# EAGLE design spin (EAGLE 6.4)
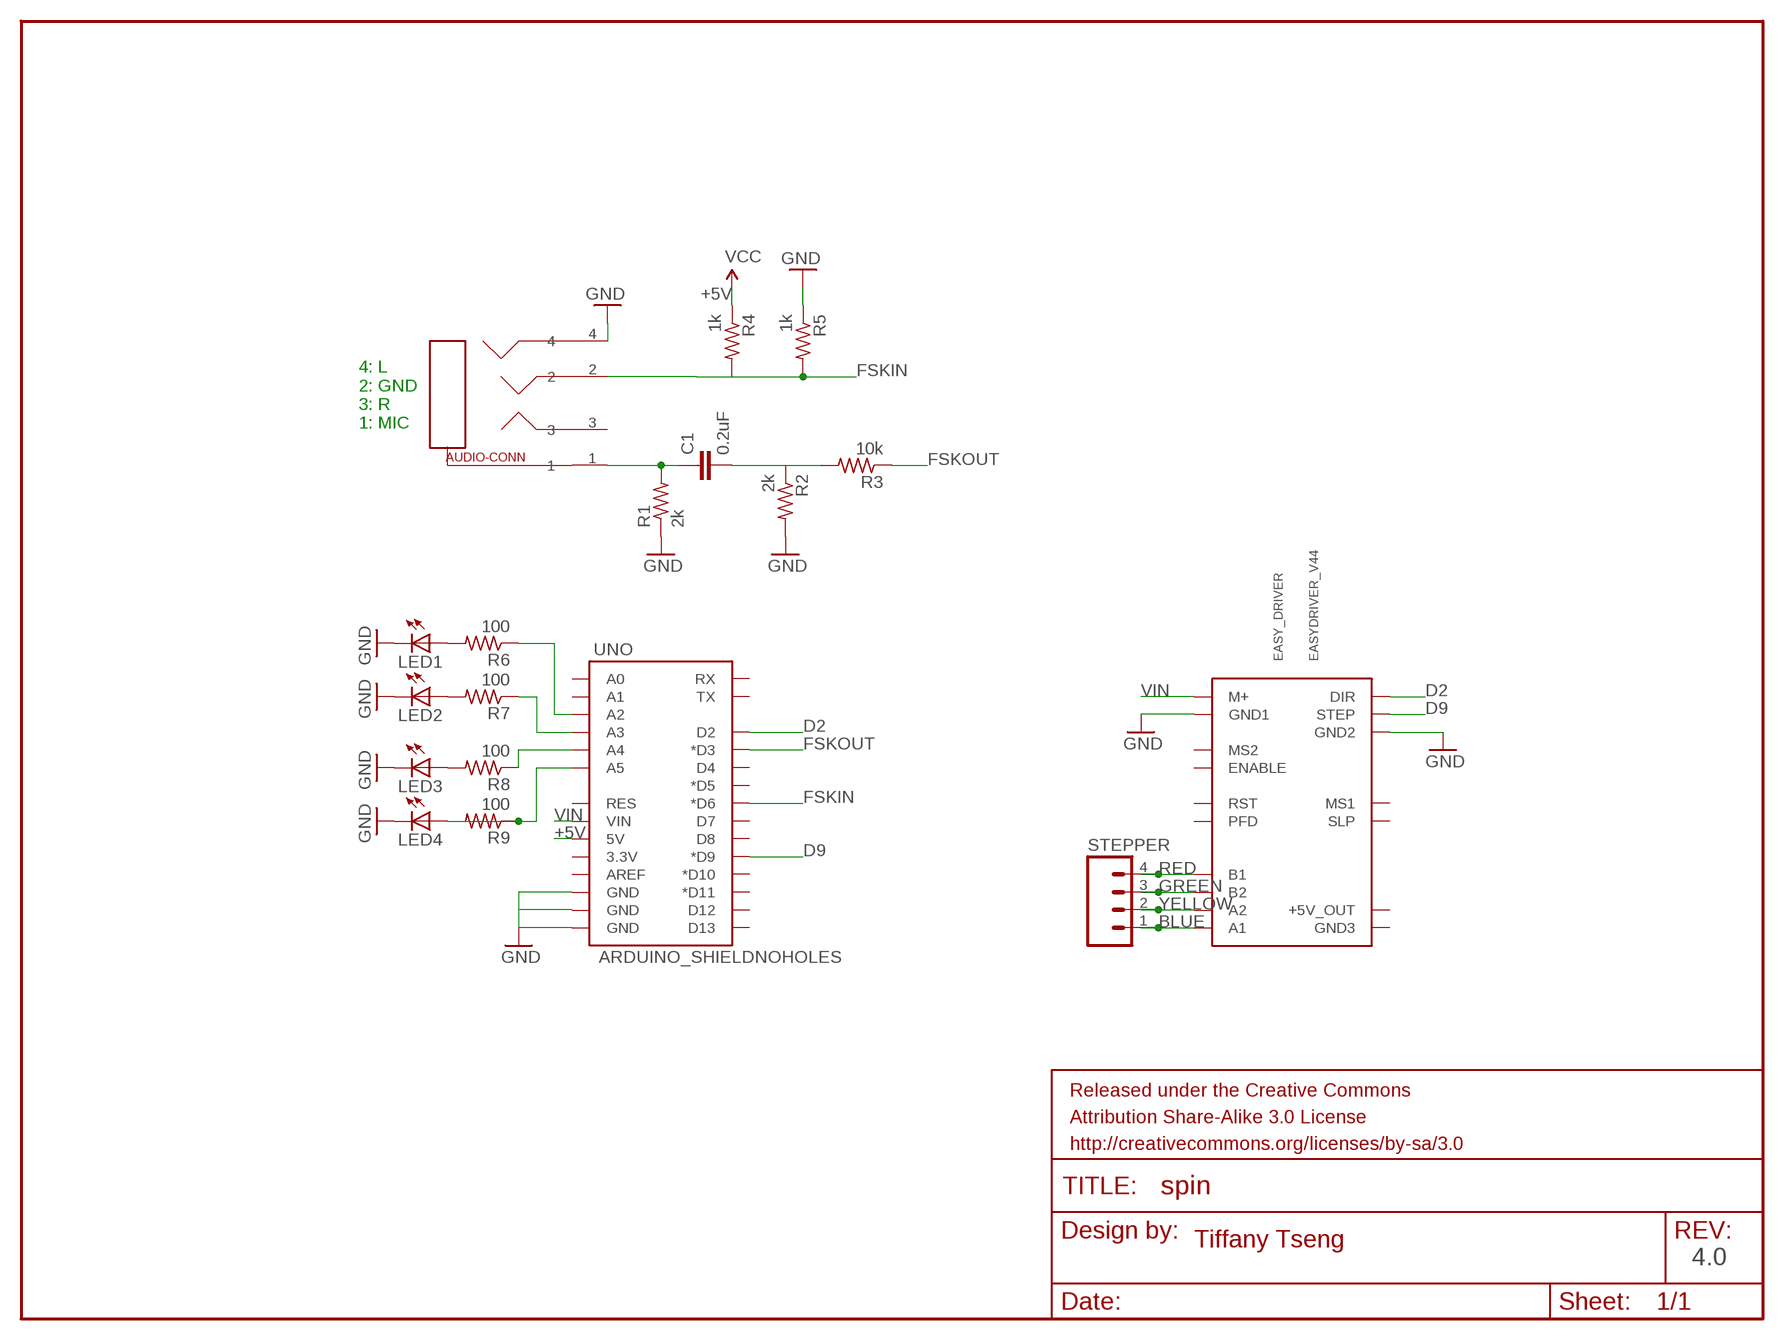
[diagram p0: schematic, sheet 1]

## Parts
C1  0.2uF  CAP1206  [1206]
EASY_DRIVER  EASYDRIVER_V44  [EASYDRIVER_V44]
FRAME1  FRAME-LETTER  [CREATIVE_COMMONS]
LED1  LED1206  [1206]
LED2  LED1206  [1206]
LED3  LED1206  [1206]
LED4  LED1206  [1206]
R1  2k  R-US_R1206  [R1206]
R2  2k  R-US_R1206  [R1206]
R3  10k  R-US_R1206  [R1206]
R4  1k  R-US_R1206  [R1206]
R5  1k  R-US_R1206  [R1206]
R6  100  R-US_R1206  [R1206]
R7  100  R-US_R1206  [R1206]
R8  100  R-US_R1206  [R1206]
R9  100  R-US_R1206  [R1206]
STEPPER  M04PTH  [1X04]
U$1  SJ-43514  [SJ-43514]
UNO  ARDUINO_SHIELDNOHOLES  [DUEMILANOVE_SHIELD_NOHOLES]

## Nets
1: C1.1 R1.2 U$1.1
+5V: R4.1 UNO.5V ; supply symbol labelled VCC
BLUE: EASY_DRIVER.A1 STEPPER.1
D2: EASY_DRIVER.DIR UNO.D2
D9: EASY_DRIVER.STEP UNO.D9(*D9)
FSKIN: R4.2 R5.2 U$1.2 UNO.D6(*D6)
FSKOUT: R3.1 UNO.D3(*D3)
GND: EASY_DRIVER.GND1 EASY_DRIVER.GND2 LED1.2(C) LED2.2(C) LED3.2(C) LED4.2(C) R1.1 R2.2 R5.1 U$1.4 UNO.GND@0(GND) UNO.GND@1(GND) UNO.GND@2(GND)
GREEN: EASY_DRIVER.B2 STEPPER.3
N$2: C1.2 R2.1 R3.2
N$10: R9.1 UNO.A5
N$11: LED1.1(A) R6.2
N$12: LED2.1(A) R7.2
N$13: R8.1 UNO.A4
N$14: LED3.1(A) R8.2
N$15: R7.1 UNO.A3
N$16: LED4.1(A) R9.2
N$17: R6.1 UNO.A2
RED: EASY_DRIVER.B1 STEPPER.4
VIN: EASY_DRIVER.M+ UNO.VIN
YELLOW: EASY_DRIVER.A2 STEPPER.2
Unconnected: EASY_DRIVER.ENABLE EASY_DRIVER.GND3 EASY_DRIVER.MS1 EASY_DRIVER.MS2 EASY_DRIVER.P$11(+5V_OUT) EASY_DRIVER.PFD EASY_DRIVER.RST EASY_DRIVER.SLEEP(SLP) U$1.3 UNO.3.3V UNO.A0 UNO.A1 UNO.AREF UNO.D4 UNO.D5(*D5) UNO.D7 UNO.D8 UNO.D10(*D10) UNO.D11(*D11) UNO.D12 UNO.D13 UNO.RES UNO.RX UNO.TX

## Notes on the sheet
- 4: L
  2: GND
  3: R
  1: MIC
- Tiffany Tseng
- 4.0

## Library data of the parts
C1 = SparkFun-Passives:CAP: Capacitor Standard 0603 ceramic capacitor, and 0.1" leaded capacitor.
EASY_DRIVER = EasyDriver:EASYDRIVER_V44: EasyDriver version 4.4 - http://www.schmalzhaus.com/EasyDriver
FRAME1 = SparkFun-Aesthetics:FRAME-LETTER: Schematic Frame Standard 8.5x11 US Letter frame
LED1-LED4 = ng:LED
R1-R9 = rcl:R-US_: RESISTOR, American symbol
STEPPER = SparkFun-Connectors:M04: Header 4 Standard 4-pin 0.1" header. Use with straight break away headers (SKU : PRT-00116), right angle break away headers (PRT-00553), swiss pins (PRT-00743), machine pins (PRT-00117), and female headers (PRT-00115). Molex polarized connector foot print use with SKU : PRT-08231 with associated crimp pins and housings. 1MM SMD Version SKU: PRT-10208
U$1 = spin:SJ-43514
UNO = SparkFun-Boards:ARDUINO_SHIELD: Arduino shield footprint

## Board
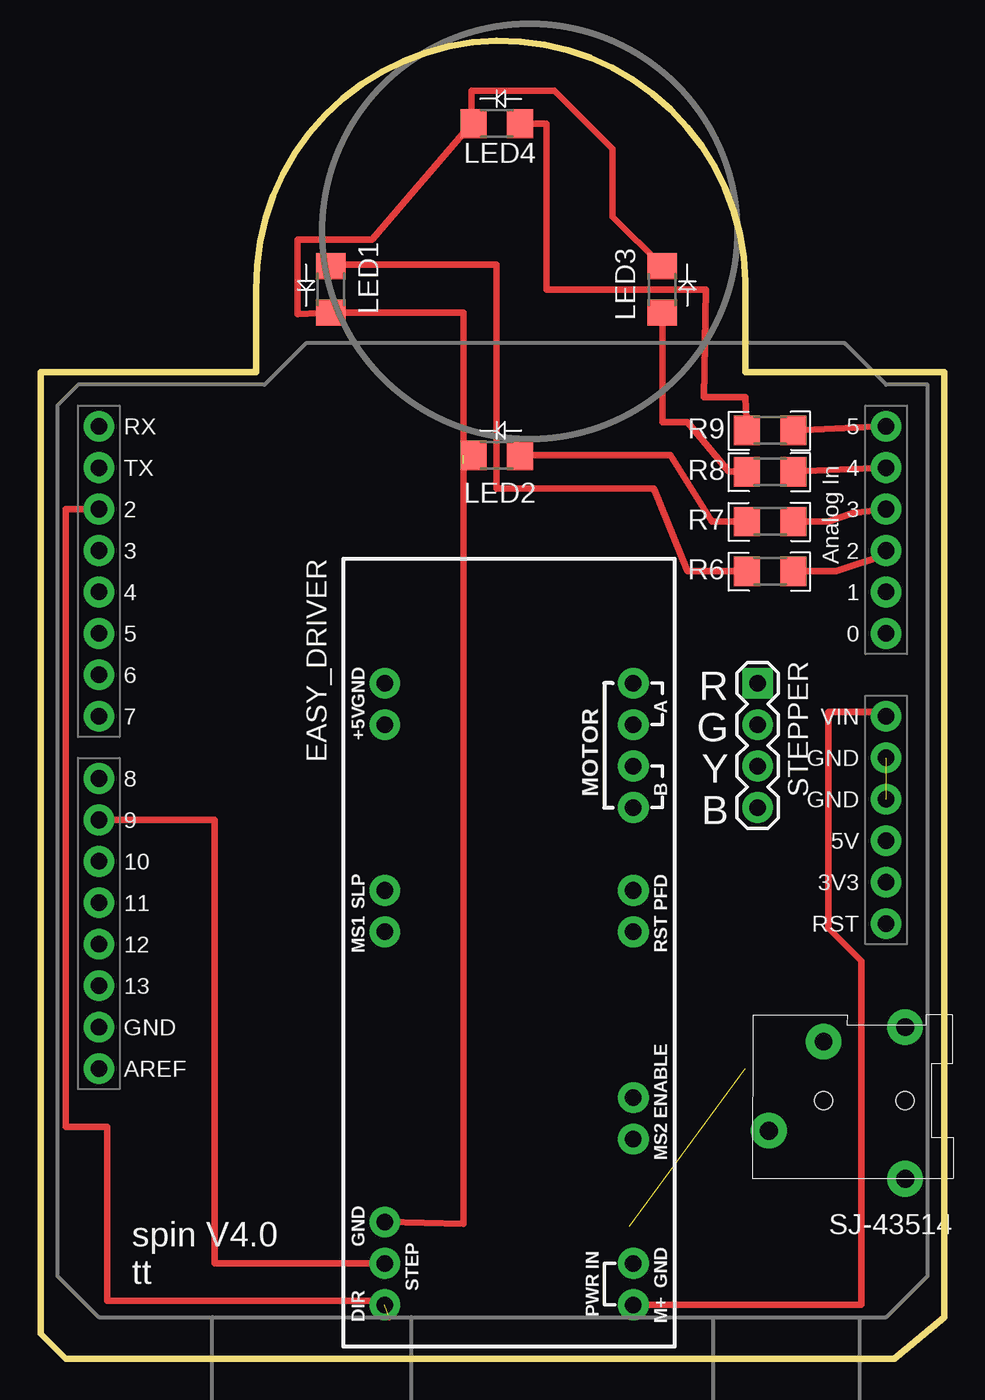
[diagram p1: board, top side]
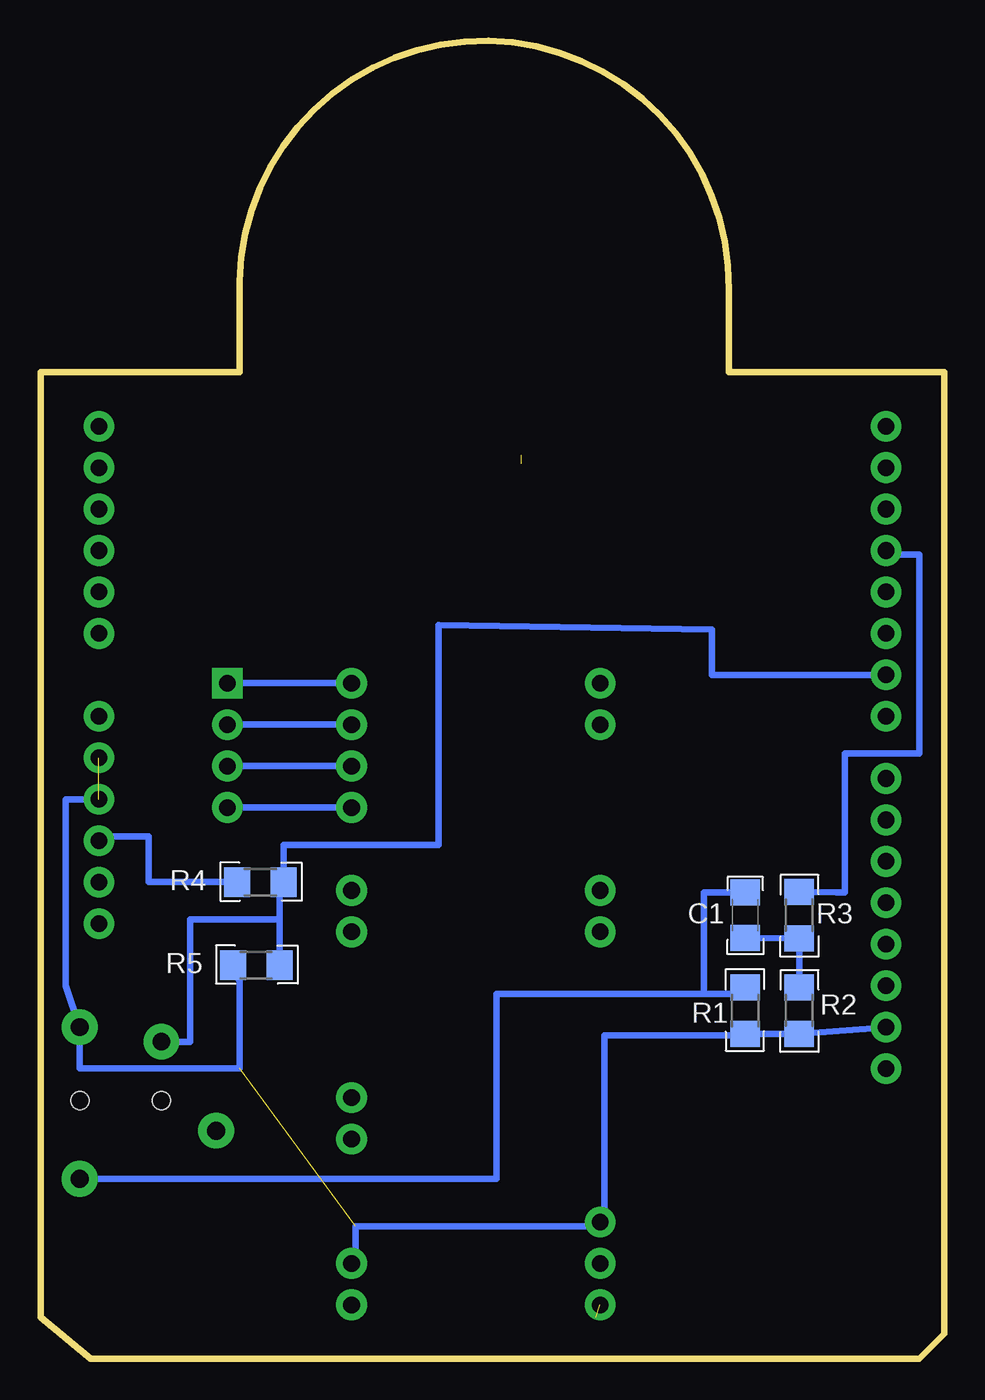
[diagram p2: board, bottom side, seen from below]

Size 55.37 x 80.77 mm. Coordinates in mm from the lower left corner, seen from the top.
Outline: 55.37,55.88 55.37,2.54 52.32,0 3.56,0 1.52,0 0,1.52 0,55.37 0,60.45 13.21,60.45 13.21,65.53 arc-180 43.18,66.04 43.18,60.45 55.37,60.45 55.37,55.88
Copper layers (1*16): Top 0.035mm / dielectric 1.5mm / Bottom 0.035mm
Design rules "default": minimum track width 10mil, minimum drill 24mil, track to track 8mil, track to pad 8mil, pad to pad 8mil, via to via 8mil, smd to smd 8mil, copper to edge 40mil, drill to drill 8mil, minimum pad ring 10mil, minimum via ring 8mil, stop-mask expansion 4mil, vias tented up to drill 0mil, thermal gap 10mil

### Footprints (pad centres in the part's own frame; a part is rotated, then mirrored left to right if it is on the bottom)
1206 = smd 1.6 x 1.8: 1 -1.4,0; 2 1.4,0
EASYDRIVER_V44 = drill 1.016 pad 1.88: A1 -16.51,7.62; A2 -13.97,7.62; B1 -8.89,7.62; B2 -11.43,7.62; DIR 21.59,-7.62; ENABLE 8.89,7.62; GND1 19.05,7.62; GND2 16.51,-7.62; GND3 -16.51,-7.62; M+ 21.59,7.62; MS1 -1.27,-7.62; MS2 11.43,7.62; P$11 -13.97,-7.62; PFD -3.81,7.62; RST -1.27,7.62; SLEEP -3.81,-7.62; STEP 19.05,-7.62
1206' = smd 1.6 x 1.803: 1 -1.422,0; 2 1.422,0
R1206 = smd 1.6 x 1.803: 1 -1.422,0; 2 1.422,0
1X04 = drill 1.016 pad 1.88 square: 1 0,0 | drill 1.016 pad 1.88: 2 2.54,0; 3 5.08,0; 4 7.62,0
SJ-43514 = drill 1.092 pad 2.184: 1 2.896,9.296; 2 7.899,0.889; 3 11.252,6.35; 4 2.896,0 | hole 1.092: 2.896,4.496; 7.899,4.496
DUEMILANOVE_SHIELD_NOHOLES = drill 1.016 pad 1.88: 3.3V 50.8,26.67; 5V 50.8,29.21; A0 50.8,41.91; A1 50.8,44.45; A2 50.8,46.99; A3 50.8,49.53; A4 50.8,52.07; A5 50.8,54.61; AREF 2.54,15.24; D2 2.54,49.53; D3 2.54,46.99; D4 2.54,44.45; D5 2.54,41.91; D6 2.54,39.37; D7 2.54,36.83; D8 2.54,33.02; D9 2.54,30.48; D10 2.54,27.94; D11 2.54,25.4; D12 2.54,22.86; D13 2.54,20.32; GND@0 50.8,31.75; GND@1 50.8,34.29; GND@2 2.54,17.78; RES 50.8,24.13; RX 2.54,54.61; TX 2.54,52.07; VIN 50.8,36.83

### Placement (x,y rotation side)
C1  12.19,27.18 270 bottom
EASY_DRIVER  28.7,24.89 270 top
FRAME1  53.34,-16.26 0 top  (outside the outline)
LED1  [1206']  17.78,65.53 270 top
LED2  [1206']  27.94,55.37 180 top
LED3  [1206']  38.1,65.53 90 top
LED4  [1206']  27.94,75.69 180 top
R1  12.19,21.34 90 bottom
R2  8.89,21.34 270 bottom
R3  8.89,27.18 270 bottom
R4  41.91,29.21 0 bottom
R5  42.16,24.13 0 bottom
R6  44.7,48.26 180 top
R7  44.7,51.31 180 top
R8  44.7,54.36 180 top
R9  44.7,56.9 180 top
STEPPER  43.94,41.4 270 top
U$1  55.88,20.32 180 top
UNO  1.02,2.54 0 top

### Tracks (layer width: path | path; a pad name or v marks a point on that pad's centre or on a via)
1
  Bottom 0.406: C1.1 14.73,28.58 14.73,22.35 | 14.73,22.35 12.19,22.35 | 12.19,22.35 R1.2 12.19,22.35 | U$1.1 27.43,11.02 27.43,22.35 14.73,22.35 | 14.73,22.35 12.19,22.35
+5V
  Bottom 0.406: R4.1 48.77,29.21 48.77,32 51.82,32 UNO.5V
BLUE
  Bottom 0.406: EASY_DRIVER.A1 STEPPER.1
D2  (1 unrouted)
  Top 0.406: UNO.D2 1.52,52.07 1.52,14.22 4.06,14.22 4.06,3.56 21.34,3.56 21.34,2.54
D9
  Top 0.406: EASY_DRIVER.STEP 10.67,5.84 10.67,33.02 UNO.D9
FSKIN
  Bottom 0.406: UNO.D6 14.22,41.91 14.22,44.7 30.99,44.96 30.99,31.5 40.49,31.5 R4.2 40.74,29.21 40.74,26.92 | 40.74,26.92 R5.2 | U$1.2 46.23,19.43 46.23,26.92 40.74,26.92
FSKOUT
  Bottom 0.406: R3.1 6.6,28.58 6.1,28.58 6.1,37.08 1.52,37.08 1.52,49.28 3.56,49.28 UNO.D3
GND  (3 unrouted)
  Top 0.406: LED4.2 26.42,75.69 | 26.42,75.69 26.42,77.72 31.5,77.72 35.05,74.17 35.05,70 LED3.2 | 26.42,75.69 20.32,68.58 15.75,68.58 15.75,64.01 LED1.2 25.91,64.11 25.91,54.86 | LED2.2 25.91,55.37 25.91,8.28 EASY_DRIVER.GND2
  Bottom 0.406: UNO.GND@2 R2.2 11.68,19.91 | 11.68,19.91 R1.1 | 11.68,19.91 11.68,19.81 20.83,19.81 20.83,8.13 21.34,8.13 21.34,8.38 EASY_DRIVER.GND2 21.08,8.13 36.07,8.13 36.07,5.84 EASY_DRIVER.GND1 | R5.1 43.18,23.11 43.18,17.78 45.21,17.78 52.98,17.78 U$1.4 53.85,22.86 53.85,34.29 UNO.GND@0
GREEN
  Bottom 0.406: EASY_DRIVER.B2 STEPPER.3
N$2
  Bottom 0.406: C1.2 R3.2 R2.1
N$10
  Top 0.406: R9.1 UNO.A5
N$11
  Top 0.406: LED1.1 17.78,67.06 23.88,67.06 27.94,67.06 27.94,53.34 37.59,53.34 39.62,48.26 R6.2
N$12
  Top 0.406: LED2.1 38.61,55.37 41.15,51.31 R7.2
N$13
  Top 0.406: R8.1 UNO.A4
N$14
  Top 0.406: R8.2 42.16,54.36 39.62,57.4 38.1,57.4 LED3.1
N$15
  Top 0.406: R7.1 48.26,51.31 49.78,51.82 UNO.A3
N$16
  Top 0.406: LED4.1 30.99,75.69 30.99,65.53 40.76,65.53 40.64,58.93 43.18,58.93 R9.2
N$17
  Top 0.406: R6.1 48.77,48.26 51.82,49.28 UNO.A2
RED
  Bottom 0.406: EASY_DRIVER.B1 STEPPER.4
VIN
  Top 0.406: EASY_DRIVER.M+ 50.29,3.3 50.29,24.38 48.26,26.42 48.26,39.62 51.82,39.62 UNO.VIN
YELLOW
  Bottom 0.406: EASY_DRIVER.A2 STEPPER.2

### Text on the board
tPlace: spin V4.0 / tt
tNames: R | G | Y | B